# Altium schematic sheet 遥控器副板.SchDoc
size A4
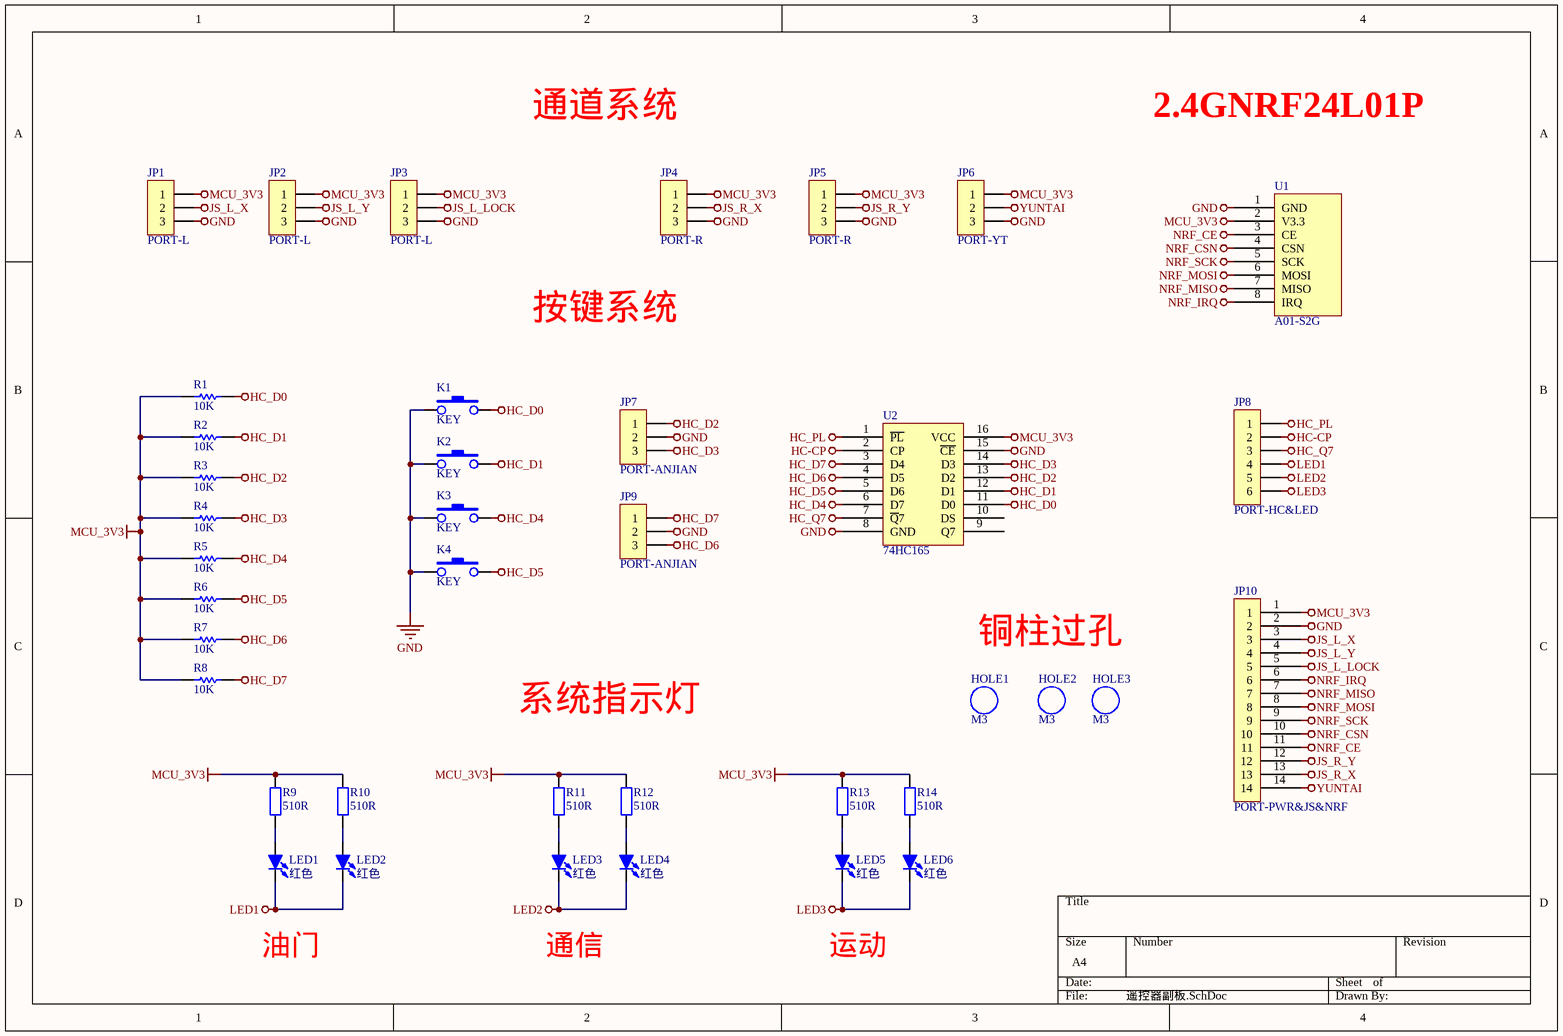
[diagram p0: 遥控器副板.SchDoc]

## Parts
HOLE1  M3  [M3 5.4MM]
HOLE2  M3  [M3 5.4MM]
HOLE3  M3  [M3 5.4MM]
JP1  PORT-L  [MX 1.25-WS-3P]
JP2  PORT-L  [MX 1.25-WS-3P]
JP3  PORT-L  [MX 1.25-WS-3P]
JP4  PORT-R  [MX 1.25-WS-3P]
JP5  PORT-R  [MX 1.25-WS-3P]
JP6  PORT-YT  [MX 1.25-WS-3P]
JP7  PORT-ANJIAN  [MX 1.25-WS-3P]
JP8  PORT-HC&LED  [SH1.0 S-W-6P]
JP9  PORT-ANJIAN  [MX 1.25-WS-3P]
JP10  PORT-PWR&JS&NRF  [Headr14]
K1  KEY  [SMD-6X6X8]
K2  KEY  [SMD-6X6X8]
K3  KEY  [SMD-6X6X8]
K4  KEY  [SMD-6X6X8]
LED1  红色  [LED 0603R]
LED2  红色  [LED 0603R]
LED3  红色  [LED 0603R]
LED4  红色  [LED 0603R]
LED5  红色  [LED 0603R]
LED6  红色  [LED 0603R]
R1  10K  [0805R]
R2  10K  [0805R]
R3  10K  [0805R]
R4  10K  [0805R]
R5  10K  [0805R]
R6  10K  [0805R]
R7  10K  [0805R]
R8  10K  [0805R]
R9  510R  [0805R]
R10  510R  [0805R]
R11  510R  [0805R]
R12  510R  [0805R]
R13  510R  [0805R]
R14  510R  [0805R]
U1  A01-S2G  [A01-S2G]
U2  74HC165  [SOP16]

## Nets
GND: JP1.3 JP2.3 JP3.3 JP4.3 JP5.3 JP6.3 JP7.2 JP9.2 JP10.2 K1.1 K2.1 K3.1 K4.1 U1.1(GND) U2.8(GND) U2.15(~{CE})
HC-CP: JP8.2 U2.2(CP)
HC_D0: K1.3 R1.2 U2.11(D0)
HC_D1: K2.3 R2.2 U2.12(D1)
HC_D2: JP7.1 R3.2 U2.13(D2)
HC_D3: JP7.3 R4.2 U2.14(D3)
HC_D4: K3.3 R5.2 U2.6(D7)
HC_D5: K4.3 R6.2 U2.5(D6)
HC_D6: JP9.3 R7.2 U2.4(D5)
HC_D7: JP9.1 R8.2 U2.3(D4)
HC_PL: JP8.1 U2.1(~{PL})
HC_Q7: JP8.3 U2.7(~{Q}7)
JS_L_LOCK: JP3.2 JP10.5
JS_L_X: JP1.2 JP10.3
JS_L_Y: JP2.2 JP10.4
JS_R_X: JP4.2 JP10.13
JS_R_Y: JP5.2 JP10.12
LED1: JP8.4 LED1.2(K) LED2.2(K)
LED2: JP8.5 LED3.2(K) LED4.2(K)
LED3: JP8.6 LED5.2(K) LED6.2(K)
MCU_3V3: JP1.1 JP2.1 JP3.1 JP4.1 JP5.1 JP6.1 JP10.1 R1.1 R2.1 R3.1 R4.1 R5.1 R6.1 R7.1 R8.1 R9.2 R10.2 R11.2 R12.2 R13.2 R14.2 U1.2(V3.3) U2.16(VCC)
NRF_CE: JP10.11 U1.3(CE)
NRF_CSN: JP10.10 U1.4(CSN)
NRF_IRQ: JP10.6 U1.8(IRQ)
NRF_MISO: JP10.7 U1.7(MISO)
NRF_MOSI: JP10.8 U1.6(MOSI)
NRF_SCK: JP10.9 U1.5(SCK)
YUNTAI: JP6.2 JP10.14
NetLED1_1: LED1.1(A) R9.1
NetLED2_1: LED2.1(A) R10.1
NetLED3_1: LED3.1(A) R11.1
NetLED4_1: LED4.1(A) R12.1
NetLED5_1: LED5.1(A) R13.1
NetLED6_1: LED6.1(A) R14.1

Not connected (* = marked no-connect by the designer): U2 9(Q7) 10(DS)

## Notes on the sheet
- 通道系统
- 2.4GNRF24L01P
- 按键系统
- 铜柱过孔
- 系统指示灯
- 油门
- 通信
- 运动

## Library data of the parts
HOLE1-HOLE3 = M3: 铜柱孔; 版权归属: 源创客; BOM名称: 铜柱孔; 学习资源: www.ooocke.com
JP1-JP7 JP9 = Header 3: 3P接插件; 版权归属: 源创客; BOM名称: 3P接插件; 学习资源: www.ooocke.com
JP8 = Header 6: 6P接插件; 版权归属: 源创客; BOM名称: 6P接插件; 学习资源: www.ooocke.com
JP10 = HEADER 14: 卧贴 14PIN 1.25mm
LED1-LED6 = LED-SMD: 贴片LED; 版权归属: 源创客; BOM名称: 贴片LED; 学习资源: www.ooocke.com
R1-R8 = RES
R9-R14 = R: 贴片电阻; 版权归属: 源创客; BOM名称: 贴片电阻; 学习资源: www.ooocke.com